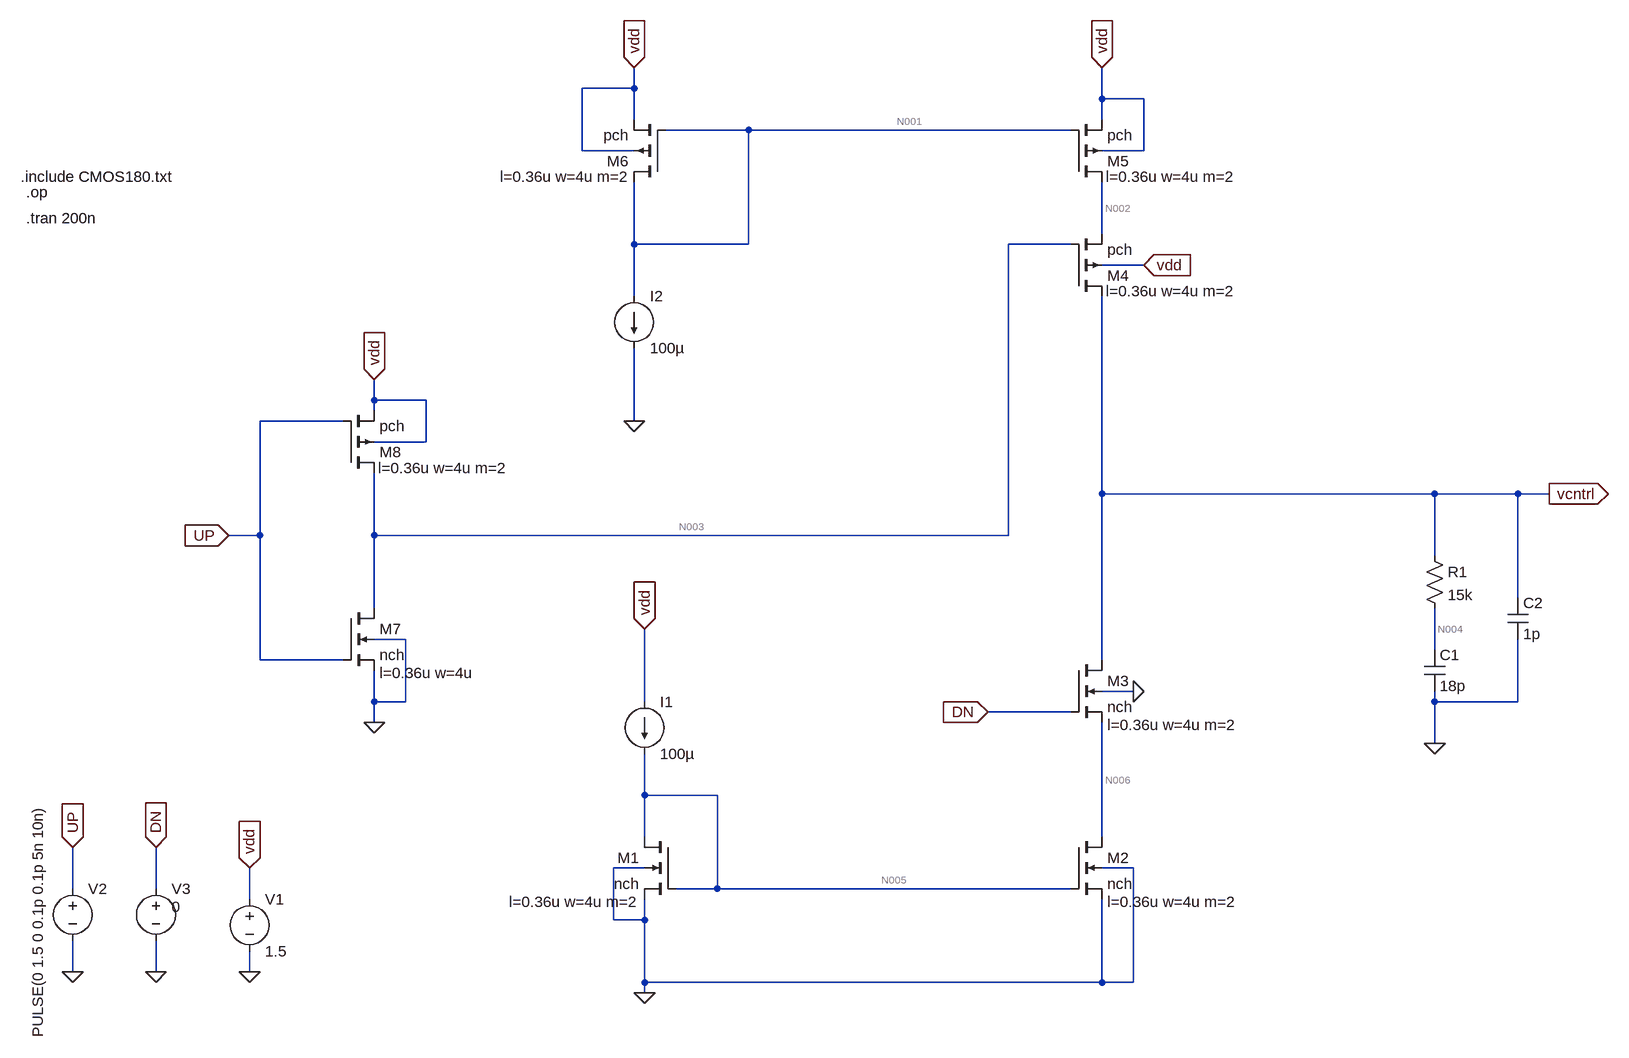
[diagram p0: schematic CP_New.asc]
CP_New.asc, the LTspice schematic file:
Version 4
SHEET 1 1360 900
WIRE -176 -816 -176 -848
WIRE -176 -816 -256 -816
WIRE 544 -800 544 -848
WIRE 608 -800 544 -800
WIRE -176 -768 -176 -816
WIRE 544 -768 544 -800
WIRE 0 -752 -128 -752
WIRE 496 -752 0 -752
WIRE -256 -720 -256 -816
WIRE -176 -720 -256 -720
WIRE 608 -720 608 -800
WIRE 608 -720 544 -720
WIRE 544 -592 544 -672
WIRE -176 -576 -176 -672
WIRE 0 -576 0 -752
WIRE 0 -576 -176 -576
WIRE 496 -576 400 -576
WIRE 608 -544 544 -544
WIRE -176 -496 -176 -576
WIRE -576 -336 -576 -368
WIRE -496 -336 -576 -336
WIRE -576 -320 -576 -336
WIRE -624 -304 -752 -304
WIRE -176 -304 -176 -416
WIRE -496 -272 -496 -336
WIRE -496 -272 -576 -272
WIRE 544 -192 544 -496
WIRE 1056 -192 544 -192
WIRE 1184 -192 1056 -192
WIRE 1232 -192 1184 -192
WIRE -752 -128 -752 -304
WIRE -752 -128 -800 -128
WIRE -576 -128 -576 -224
WIRE 400 -128 400 -576
WIRE 400 -128 -576 -128
WIRE 1056 -96 1056 -192
WIRE 1184 -32 1184 -192
WIRE -576 -16 -576 -128
WIRE -528 32 -576 32
WIRE 1056 48 1056 -16
WIRE -752 64 -752 -128
WIRE -624 64 -752 64
WIRE 544 64 544 -192
WIRE 592 112 544 112
WIRE -576 128 -576 80
WIRE -528 128 -528 32
WIRE -528 128 -576 128
WIRE -160 128 -160 16
WIRE 1056 128 1056 112
WIRE 1184 128 1184 32
WIRE 1184 128 1056 128
WIRE 496 144 368 144
WIRE -576 160 -576 128
WIRE 1056 192 1056 128
WIRE -160 272 -160 208
WIRE -48 272 -160 272
WIRE -160 336 -160 272
WIRE 544 336 544 160
WIRE -160 384 -208 384
WIRE 592 384 544 384
WIRE -1040 416 -1040 352
WIRE -912 416 -912 352
WIRE -48 416 -48 272
WIRE -48 416 -112 416
WIRE 496 416 -48 416
WIRE -768 432 -768 384
WIRE -208 464 -208 384
WIRE -160 464 -160 432
WIRE -160 464 -208 464
WIRE -1040 544 -1040 496
WIRE -912 544 -912 496
WIRE -768 544 -768 512
WIRE -160 560 -160 464
WIRE 544 560 544 432
WIRE 544 560 -160 560
WIRE 592 560 592 384
WIRE 592 560 544 560
WIRE -160 576 -160 560
FLAG -160 576 0
FLAG 592 112 0
FLAG -768 544 0
FLAG -768 384 vdd
IOPIN -768 384 In
FLAG 608 -544 vdd
IOPIN 608 -544 In
FLAG -176 -304 0
FLAG 1056 192 0
FLAG 1232 -192 vcntrl
IOPIN 1232 -192 Out
FLAG -1040 544 0
FLAG -912 544 0
FLAG -912 352 DN
IOPIN -912 352 In
FLAG -1040 352 UP
IOPIN -1040 352 In
FLAG 368 144 DN
IOPIN 368 144 In
FLAG -576 160 0
FLAG -800 -128 UP
IOPIN -800 -128 In
FLAG -176 -848 vdd
IOPIN -176 -848 In
FLAG 544 -848 vdd
IOPIN 544 -848 In
FLAG -160 16 vdd
IOPIN -160 16 In
FLAG -576 -368 vdd
IOPIN -576 -368 In
SYMBOL nmos4 -112 336 M0
WINDOW 123 56 100 Left 2
SYMATTR Value2 l=0.36u w=4u m=2
SYMATTR InstName M1
SYMATTR Value nch
SYMBOL current -160 128 R0
WINDOW 123 0 0 Left 0
WINDOW 39 0 0 Left 0
SYMATTR InstName I1
SYMATTR Value 100µ
SYMBOL nmos4 496 336 R0
WINDOW 123 56 100 Left 2
SYMATTR Value2 l=0.36u w=4u m=2
SYMATTR InstName M2
SYMATTR Value nch
SYMBOL nmos4 496 64 R0
WINDOW 123 56 100 Left 2
SYMATTR Value2 l=0.36u w=4u m=2
SYMATTR InstName M3
SYMATTR Value nch
SYMBOL pmos4 496 -496 M180
WINDOW 123 54 8 Left 2
SYMATTR Value2 l=0.36u w=4u m=2
SYMATTR InstName M4
SYMATTR Value pch
SYMBOL voltage -768 416 R0
WINDOW 123 0 0 Left 0
WINDOW 39 0 0 Left 0
SYMATTR InstName V1
SYMATTR Value 1.5
SYMBOL pmos4 496 -672 M180
WINDOW 123 54 8 Left 2
SYMATTR Value2 l=0.36u w=4u m=2
SYMATTR InstName M5
SYMATTR Value pch
SYMBOL pmos4 -128 -672 R180
WINDOW 123 54 8 Left 2
SYMATTR Value2 l=0.36u w=4u m=2
SYMATTR InstName M6
SYMATTR Value pch
SYMBOL current -176 -496 R0
WINDOW 123 0 0 Left 0
WINDOW 39 0 0 Left 0
SYMATTR InstName I2
SYMATTR Value 100µ
SYMBOL res 1040 -112 R0
SYMATTR InstName R1
SYMATTR Value 15k
SYMBOL cap 1040 48 R0
SYMATTR InstName C1
SYMATTR Value 18p
SYMBOL cap 1168 -32 R0
SYMATTR InstName C2
SYMATTR Value 1p
SYMBOL voltage -1040 400 R0
WINDOW 3 -54 -113 VRight 2
WINDOW 123 0 0 Left 0
WINDOW 39 0 0 Left 0
SYMATTR Value PULSE(0 1.5 0 0.1p 0.1p 5n 10n)
SYMATTR InstName V2
SYMBOL voltage -912 400 R0
WINDOW 3 24 44 Left 2
WINDOW 123 0 0 Left 0
WINDOW 39 0 0 Left 0
SYMATTR Value 0
SYMATTR InstName V3
SYMBOL nmos4 -624 -16 R0
WINDOW 123 56 100 Left 2
SYMATTR Value2 l=0.36u w=4u
SYMATTR InstName M7
SYMATTR Value nch
SYMBOL pmos4 -624 -224 M180
WINDOW 123 54 8 Left 2
SYMATTR Value2 l=0.36u w=4u m=2
SYMATTR InstName M8
SYMATTR Value pch
TEXT -1120 -680 Left 2 !.include CMOS180.txt
TEXT -1112 -656 Left 2 !.op
TEXT -1112 -616 Left 2 !.tran 200n

The netlist it stands for:
* CP_New.asc
M1 N005 N005 0 0 nch l=0.36u w=4u m=2
I1 vdd N005 100µ
M2 N006 N005 0 0 nch l=0.36u w=4u m=2
M3 vcntrl DN N006 0 nch l=0.36u w=4u m=2
M4 vcntrl N003 N002 vdd pch l=0.36u w=4u m=2
V1 vdd 0 1.5
M5 N002 N001 vdd vdd pch l=0.36u w=4u m=2
M6 N001 N001 vdd vdd pch l=0.36u w=4u m=2
I2 N001 0 100µ
R1 vcntrl N004 15k
C1 N004 0 18p
C2 vcntrl 0 1p
V2 UP 0 PULSE(0 1.5 0 0.1p 0.1p 5n 10n)
V3 DN 0 0
M7 N003 UP 0 0 nch l=0.36u w=4u
M8 N003 UP vdd vdd pch l=0.36u w=4u m=2
.model NMOS NMOS
.model PMOS PMOS
.lib standard.mos
.include CMOS180.txt
.op
.tran 200n
.backanno
.end

* Results of the author's LTspice run, read from the files saved beside the schematic
* Operating Point, zero values left out:
*   V(n005) = 652.2 mV
*   V(vdd) = 1.5 V
*   V(n006) = 17.78 nV
*   V(vcntrl) = 535.4 mV
*   V(n003) = 1.5 V
*   V(n002) = 1.5 V
*   V(n001) = 692.9 mV
*   V(n004) = 535.4 mV
*   Id(M8) = -15.6 pA
*   Is(M8) = 15.6 pA
*   Id(M6) = -100 µA
*   Ib(M6) = 1.634 pA
*   Is(M6) = 100 µA
*   Id(M5) = -19.43 pA
*   Is(M5) = 19.43 pA
*   Id(M4) = -21.38 pA
*   Ib(M4) = 1.949 pA
*   Is(M4) = 19.43 pA
*   Id(M7) = 15.6 pA
*   Ib(M7) = -1.51 pA
*   Is(M7) = -14.09 pA
*   Id(M3) = 21.38 pA
*   Ib(M3) = -1.091 pA
*   Is(M3) = -20.29 pA
*   Id(M2) = 20.29 pA
*   Is(M2) = -20.29 pA
*   Id(M1) = 100 µA
*   Ib(M1) = -1.324 pA
*   Is(M1) = -100 µA
*   I(I2) = 100 µA
*   I(I1) = 100 µA
*   I(V1) = -200 µA
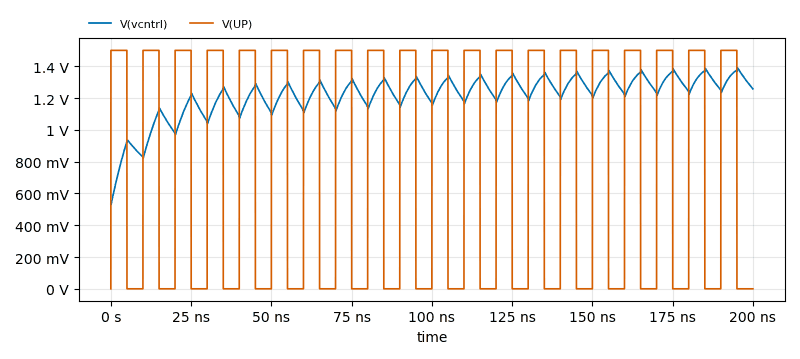
[diagram p1: Transient Analysis of CP_New.asc, plotted from the saved traces]
* Transient Analysis, 1 run:
*   V(vcntrl): min 529.1 mV, max 1.393 V, average 1.218 V, rms 1.225 V, last 1.257 V
*   V(UP): min 0 V, max 1.5 V, average 750 mV, rms 1.061 V, last 0 V